# EAGLE schematic conn_board_v0.1 (EAGLE 8.0.1)
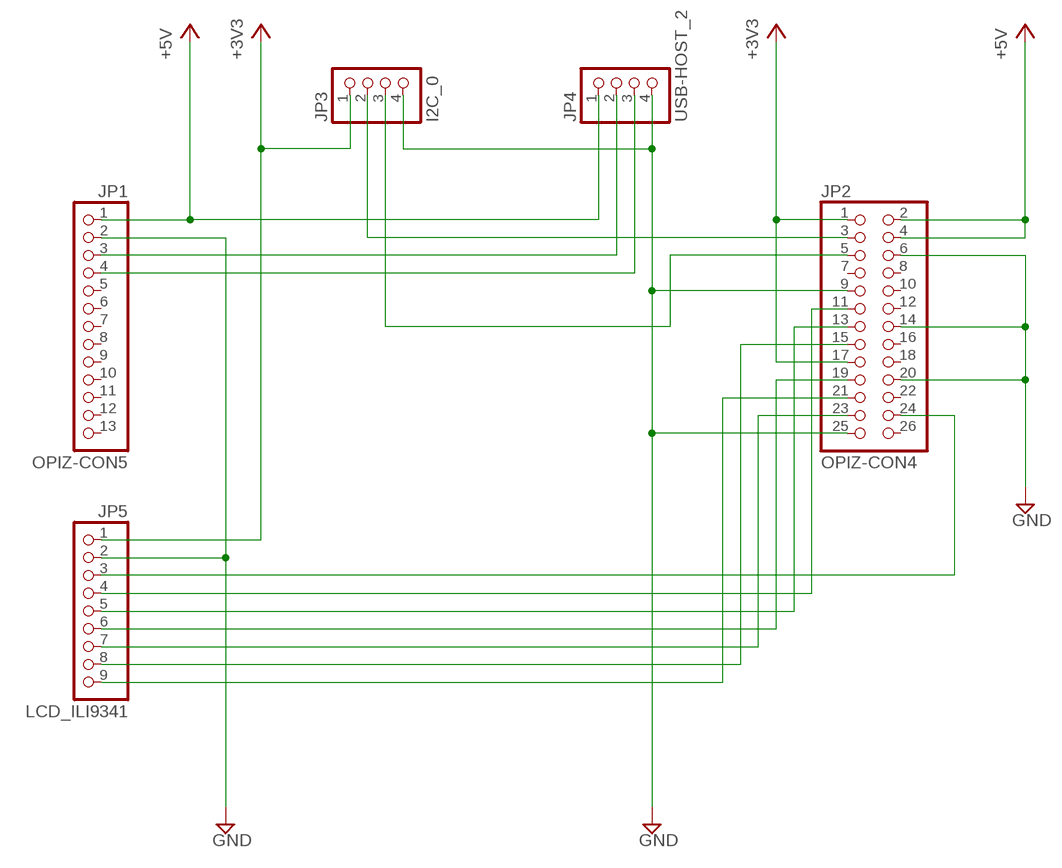
[diagram p0: schematic, sheet 1]

## Parts
JP1  OPIZ-CON5  PINHD-1X13  [1X13]
JP2  OPIZ-CON4  PINHD-2X13  [2X13]
JP3  I2C_0  PINHD-1X4  [1X04]
JP4  USB-HOST_2  PINHD-1X4  [1X04]
JP5  LCD_ILI9341  PINHD-1X9  [1X09]

## Nets
+3V3: JP2.1 JP2.17 JP3.1 JP5.1
+5V: JP1.1 JP2.2 JP2.4 JP4.1
GND: JP1.2 JP2.6 JP2.9 JP2.14 JP2.20 JP2.25 JP3.4 JP4.4 JP5.2
I2C0_SCK: JP2.5 JP3.3
I2C0_SDA: JP2.3 JP3.2
LCD_LED: JP2.15 JP5.8
LCD_RESET: JP2.11 JP5.4
LCS_DC: JP2.13 JP5.5
SPI_CS: JP2.24 JP5.3
SPI_MISO: JP2.21 JP5.9
SPI_MOSI: JP2.19 JP5.6
SPI_SCK: JP2.23 JP5.7
USB_DM2: JP1.3 JP4.2
USB_DP2: JP1.4 JP4.3
Unconnected: JP1.5 JP1.6 JP1.7 JP1.8 JP1.9 JP1.10 JP1.11 JP1.12 JP1.13 JP2.7 JP2.8 JP2.10 JP2.12 JP2.16 JP2.18 JP2.22 JP2.26

## Library data of the parts
JP1 = pinhead:PINHD-1X13: PIN HEADER
JP2 = pinhead:PINHD-2X13: PIN HEADER
JP3 JP4 = pinhead:PINHD-1X4: PIN HEADER
JP5 = pinhead:PINHD-1X9: PIN HEADER